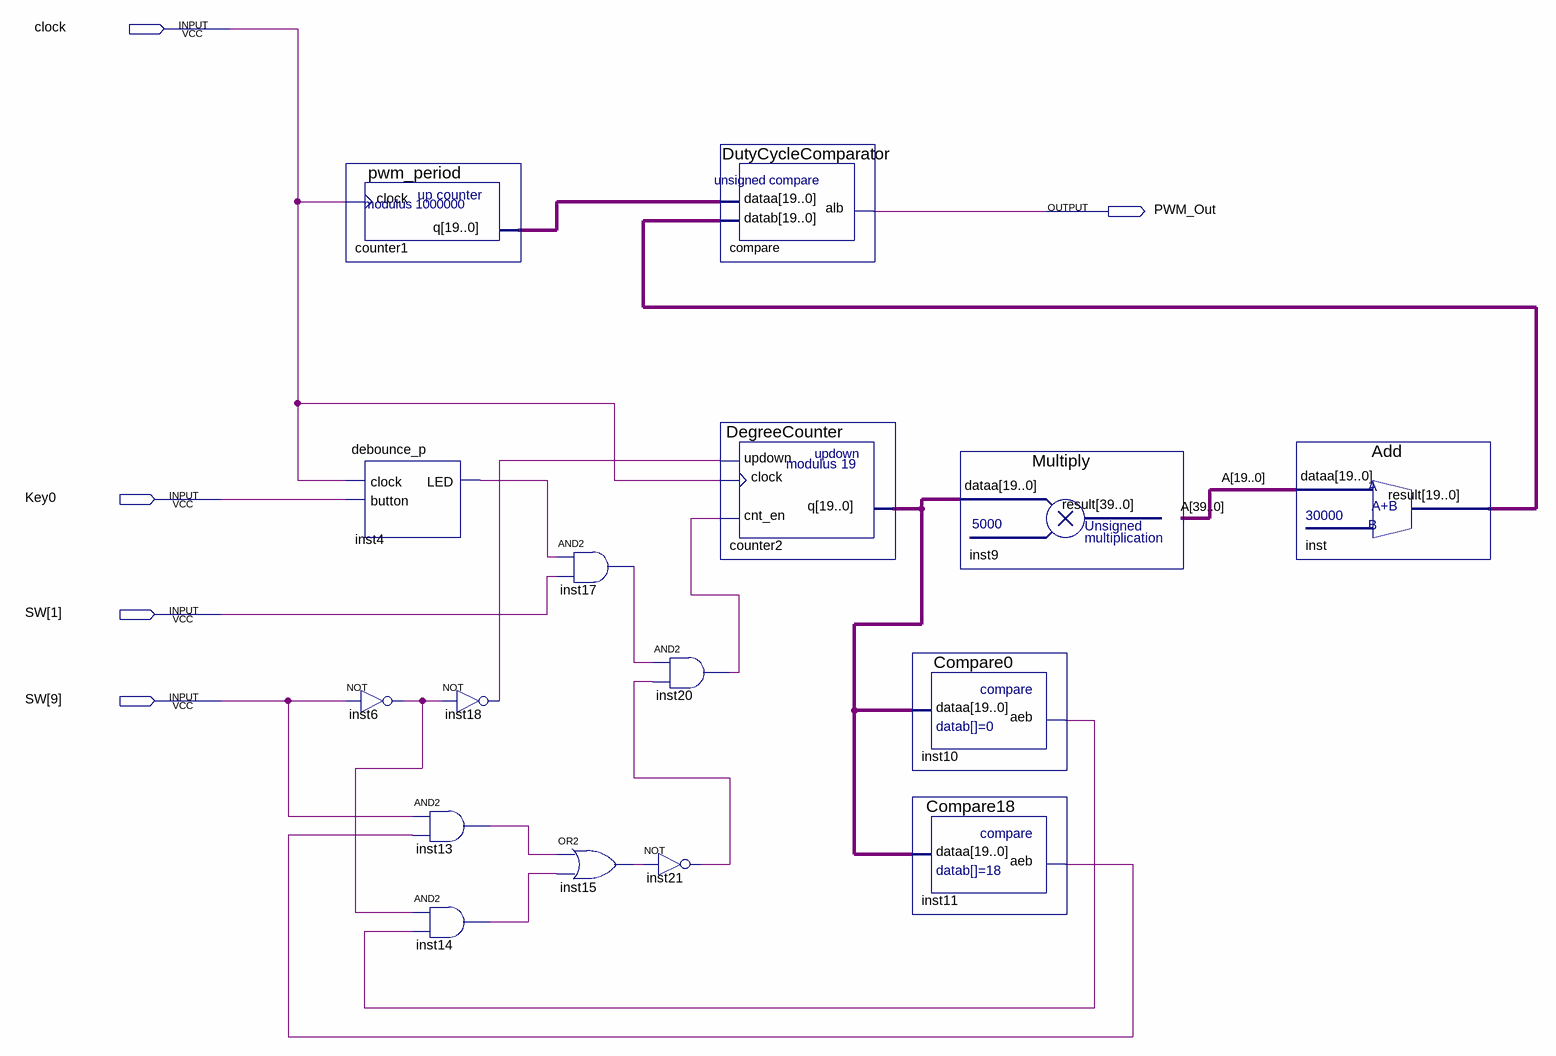
[diagram p0: schematic sheet]
// Quartus schematic OneServo.bdf as structural Verilog: 16 symbols, 5 pins
module OneServo (
  input  clock,
  input  Key0,
  input  [9:1] SW,
  output PWM_Out
);

  wire inst4_led, inst6_out, inst10_aeb, inst11_aeb, inst13_out, inst14_out, inst15_out, inst17_out,
       inst18_out, inst20_out, inst21_out;
  wire [19:0] counter1_q, counter2_q, inst_result;
  wire [39:0] A;

  pwm_period counter1 (.clock(clock), .q(counter1_q));
  debounce_p inst4 (.clock(clock), .button(Key0), .LED(inst4_led));
  not inst6 (inst6_out, SW[9]);
  and inst13 (inst13_out, SW[9], inst11_aeb);
  and inst14 (inst14_out, inst6_out, inst10_aeb);
  not inst18 (inst18_out, inst6_out);
  and inst17 (inst17_out, inst4_led, SW[1]);
  or inst15 (inst15_out, inst13_out, inst14_out);
  not inst21 (inst21_out, inst15_out);
  DutyCycleComparator compare (.dataa(counter1_q), .datab(inst_result), .alb(PWM_Out));
  DegreeCounter counter2 (.updown(inst18_out), .clock(clock), .cnt_en(inst20_out), .q(counter2_q));
  and inst20 (inst20_out, inst17_out, inst21_out);
  Compare0 inst10 (.dataa(counter2_q), .aeb(inst10_aeb));
  Compare18 inst11 (.dataa(counter2_q), .aeb(inst11_aeb));
  Multiply inst9 (.dataa(counter2_q), .result(A));
  Add inst (.dataa(A[19:0]), .result(inst_result));
endmodule
